# Altium schematic sheet Schematic.SchDoc
size 420 x 297 mm; SheetNumber: 1; SheetTotal: 1
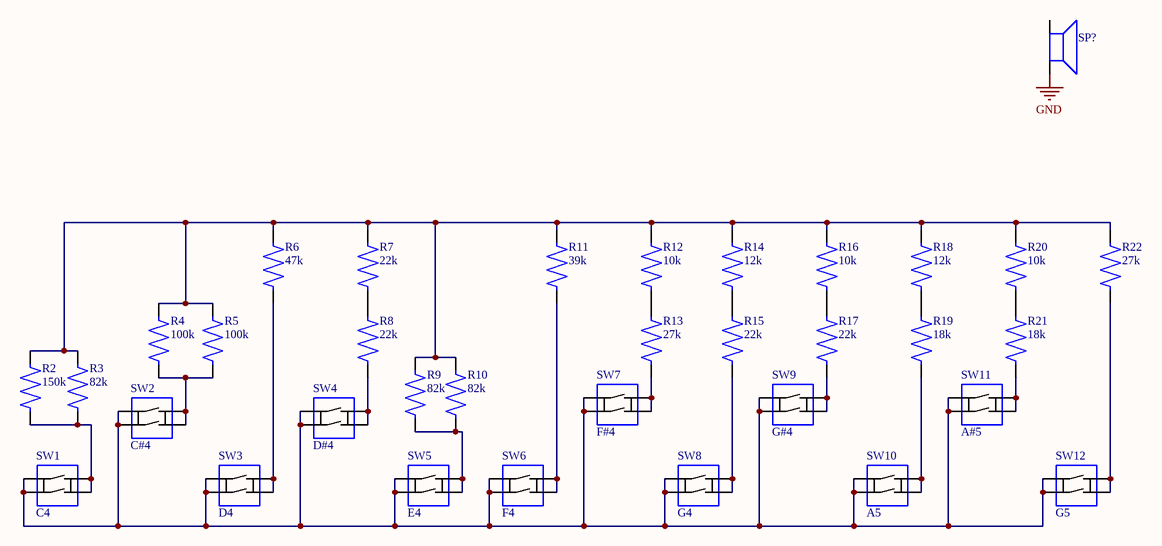
[diagram p0: Schematic.SchDoc]

## Parts
R2  150k  [Resistor]
R3  82k  [Resistor]
R4  100k  [Resistor]
R5  100k  [Resistor]
R6  47k  [Resistor]
R7  22k  [Resistor]
R8  22k  [Resistor]
R9  82k  [Resistor]
R10  82k  [Resistor]
R11  39k  [Resistor]
R12  10k  [Resistor]
R13  27k  [Resistor]
R14  12k  [Resistor]
R15  22k  [Resistor]
R16  10k  [Resistor]
R17  22k  [Resistor]
R18  12k  [Resistor]
R19  18k  [Resistor]
R20  10k  [Resistor]
R21  18k  [Resistor]
R22  27k  [Resistor]
SP?  Small 8R PCB mount Speaker  [Speaker]  (value not drawn)
SW1  C4  [Button]
SW2  C#4  [Button]
SW3  D4  [Button]
SW4  D#4  [Button]
SW5  E4  [Button]
SW6  F4  [Button]
SW7  F#4  [Button]
SW8  G4  [Button]
SW9  G#4  [Button]
SW10  A5  [Button]
SW11  A#5  [Button]
SW12  G5  [Button]

## Nets
GND: SP?.2
NetR2_1: R2.1 R3.1 SW1.3 SW1.4
NetR2_2: R2.2 R3.2 R4.2 R5.2 R6.2 R7.2 R9.2 R10.2 R11.2 R12.2 R14.2 R16.2 R18.2 R20.2 R22.2
NetR4_1: R4.1 R5.1 SW2.3 SW2.4
NetR6_1: R6.1 SW3.3 SW3.4
NetR7_1: R7.1 R8.2
NetR8_1: R8.1 SW4.3 SW4.4
NetR9_1: R9.1 R10.1 SW5.3 SW5.4
NetR11_1: R11.1 SW6.3 SW6.4
NetR12_1: R12.1 R13.2
NetR13_1: R13.1 SW7.3 SW7.4
NetR14_1: R14.1 R15.2
NetR15_1: R15.1 SW8.3 SW8.4
NetR16_1: R16.1 R17.2
NetR17_1: R17.1 SW9.3 SW9.4
NetR18_1: R18.1 R19.2
NetR19_1: R19.1 SW10.3 SW10.4
NetR20_1: R20.1 R21.2
NetR21_1: R21.1 SW11.3 SW11.4
NetR22_1: R22.1 SW12.3 SW12.4
NetSW1_1: SW1.1 SW1.2 SW2.1 SW2.2 SW3.1 SW3.2 SW4.1 SW4.2 SW5.1 SW5.2 SW6.1 SW6.2 SW7.1 SW7.2 SW8.1 SW8.2 SW9.1 SW9.2 SW10.1 SW10.2 SW11.1 SW11.2 SW12.1 SW12.2

Not connected (* = marked no-connect by the designer): SP? 1

## Notes on the sheet
- REVISION
- DATE
- FILE NAME
- DESCRIPTION
- PROJECT
- APPROVED
- NOTES
- SHEET
- OF
- A3
- SIZE

## Library data of the parts
R2-R22 = Resistor
SP? = Speaker
SW1-SW12 = Button